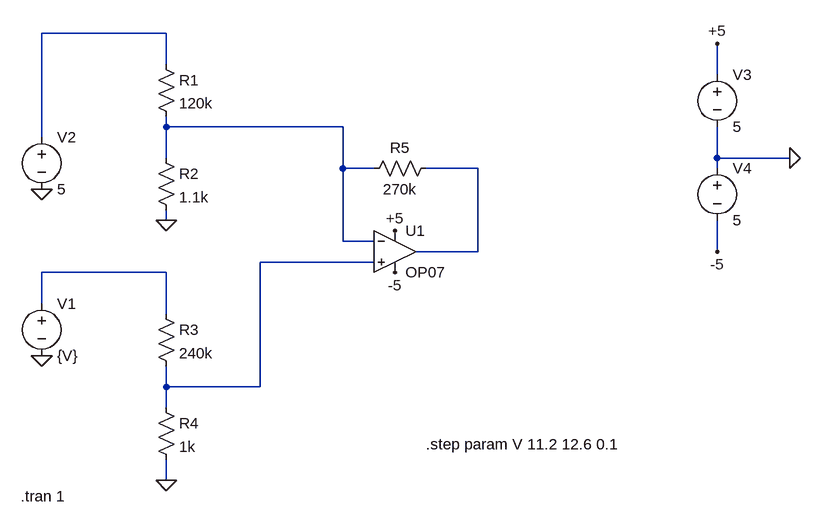
[diagram p0: schematic Battery Voltage level.asc]
Battery Voltage level.asc, the LTspice schematic file:
Version 4
SHEET 1 1204 680
WIRE 224 -368 32 -368
WIRE 224 -320 224 -368
WIRE 1072 -304 1072 -352
WIRE 224 -224 224 -240
WIRE 496 -224 224 -224
WIRE 32 -208 32 -368
WIRE 224 -176 224 -224
WIRE 1072 -176 1072 -224
WIRE 1184 -176 1072 -176
WIRE 496 -160 496 -224
WIRE 544 -160 496 -160
WIRE 704 -160 624 -160
WIRE 1072 -160 1072 -176
WIRE 224 -80 224 -96
WIRE 496 -48 496 -160
WIRE 544 -48 496 -48
WIRE 704 -32 704 -160
WIRE 704 -32 608 -32
WIRE 1072 -32 1072 -80
WIRE 544 -16 368 -16
WIRE 224 0 32 0
WIRE 32 48 32 0
WIRE 224 64 224 0
WIRE 224 176 224 144
WIRE 368 176 368 -16
WIRE 368 176 224 176
WIRE 224 208 224 176
WIRE 224 320 224 288
FLAG 32 -128 0
FLAG 32 128 0
FLAG 224 -80 0
FLAG 224 320 0
FLAG 1184 -176 0
FLAG 1072 -352 +5
FLAG 576 -64 +5
FLAG 1072 -32 -5
FLAG 576 0 -5
SYMBOL voltage 32 32 R0
WINDOW 123 0 0 Left 0
WINDOW 39 0 0 Left 0
SYMATTR InstName V1
SYMATTR Value {V}
SYMBOL voltage 32 -224 R0
WINDOW 123 0 0 Left 0
WINDOW 39 0 0 Left 0
SYMATTR InstName V2
SYMATTR Value 5
SYMBOL res 208 -336 R0
SYMATTR InstName R1
SYMATTR Value 120k
SYMBOL res 208 -192 R0
SYMATTR InstName R2
SYMATTR Value 1.1k
SYMBOL res 208 48 R0
SYMATTR InstName R3
SYMATTR Value 240k
SYMBOL res 208 192 R0
SYMATTR InstName R4
SYMATTR Value 1k
SYMBOL OpAmps\\OP07 576 -96 R0
SYMATTR InstName U1
SYMBOL res 640 -176 R90
WINDOW 0 0 56 VBottom 2
WINDOW 3 32 56 VTop 2
SYMATTR InstName R5
SYMATTR Value 270k
SYMBOL voltage 1072 -320 R0
WINDOW 123 0 0 Left 0
WINDOW 39 0 0 Left 0
SYMATTR InstName V3
SYMATTR Value 5
SYMBOL voltage 1072 -176 R0
WINDOW 123 0 0 Left 0
WINDOW 39 0 0 Left 0
SYMATTR InstName V4
SYMATTR Value 5
TEXT 624 264 Left 2 !.step param V 11.2 12.6 0.1
TEXT 0 344 Left 2 !.tran 1

The netlist it stands for:
* Battery Voltage level.asc
V1 N005 0 {V}
V2 N001 0 5
R1 N001 N002 120k
R2 N002 0 1.1k
R3 N005 N004 240k
R4 N004 0 1k
XU1 N004 N002 +5 -5 N003 LT1001  ; OP07, pins In+ In- V+ V- OUT
R5 N003 N002 270k
V3 +5 0 5
V4 0 -5 5
.step param V 11.2 12.6 0.1
.tran 1
.lib LTC.lib
.backanno
.end